# Altium schematic sheet UVB LED Controller.SchDoc: UVB LED Controller
size A3; Author: Peake J; CompanyName: Scion Research; DrawnBy: Peake J; Engineer: Peake J; Organization: Scion; Address1: 49 Sala St; Address2: Whakarewarewa; Address3: Rotorua; Address4: New Zealand 3010; DocumentNumber: NA; Revision: 0; SheetNumber: 1; SheetTotal: 2
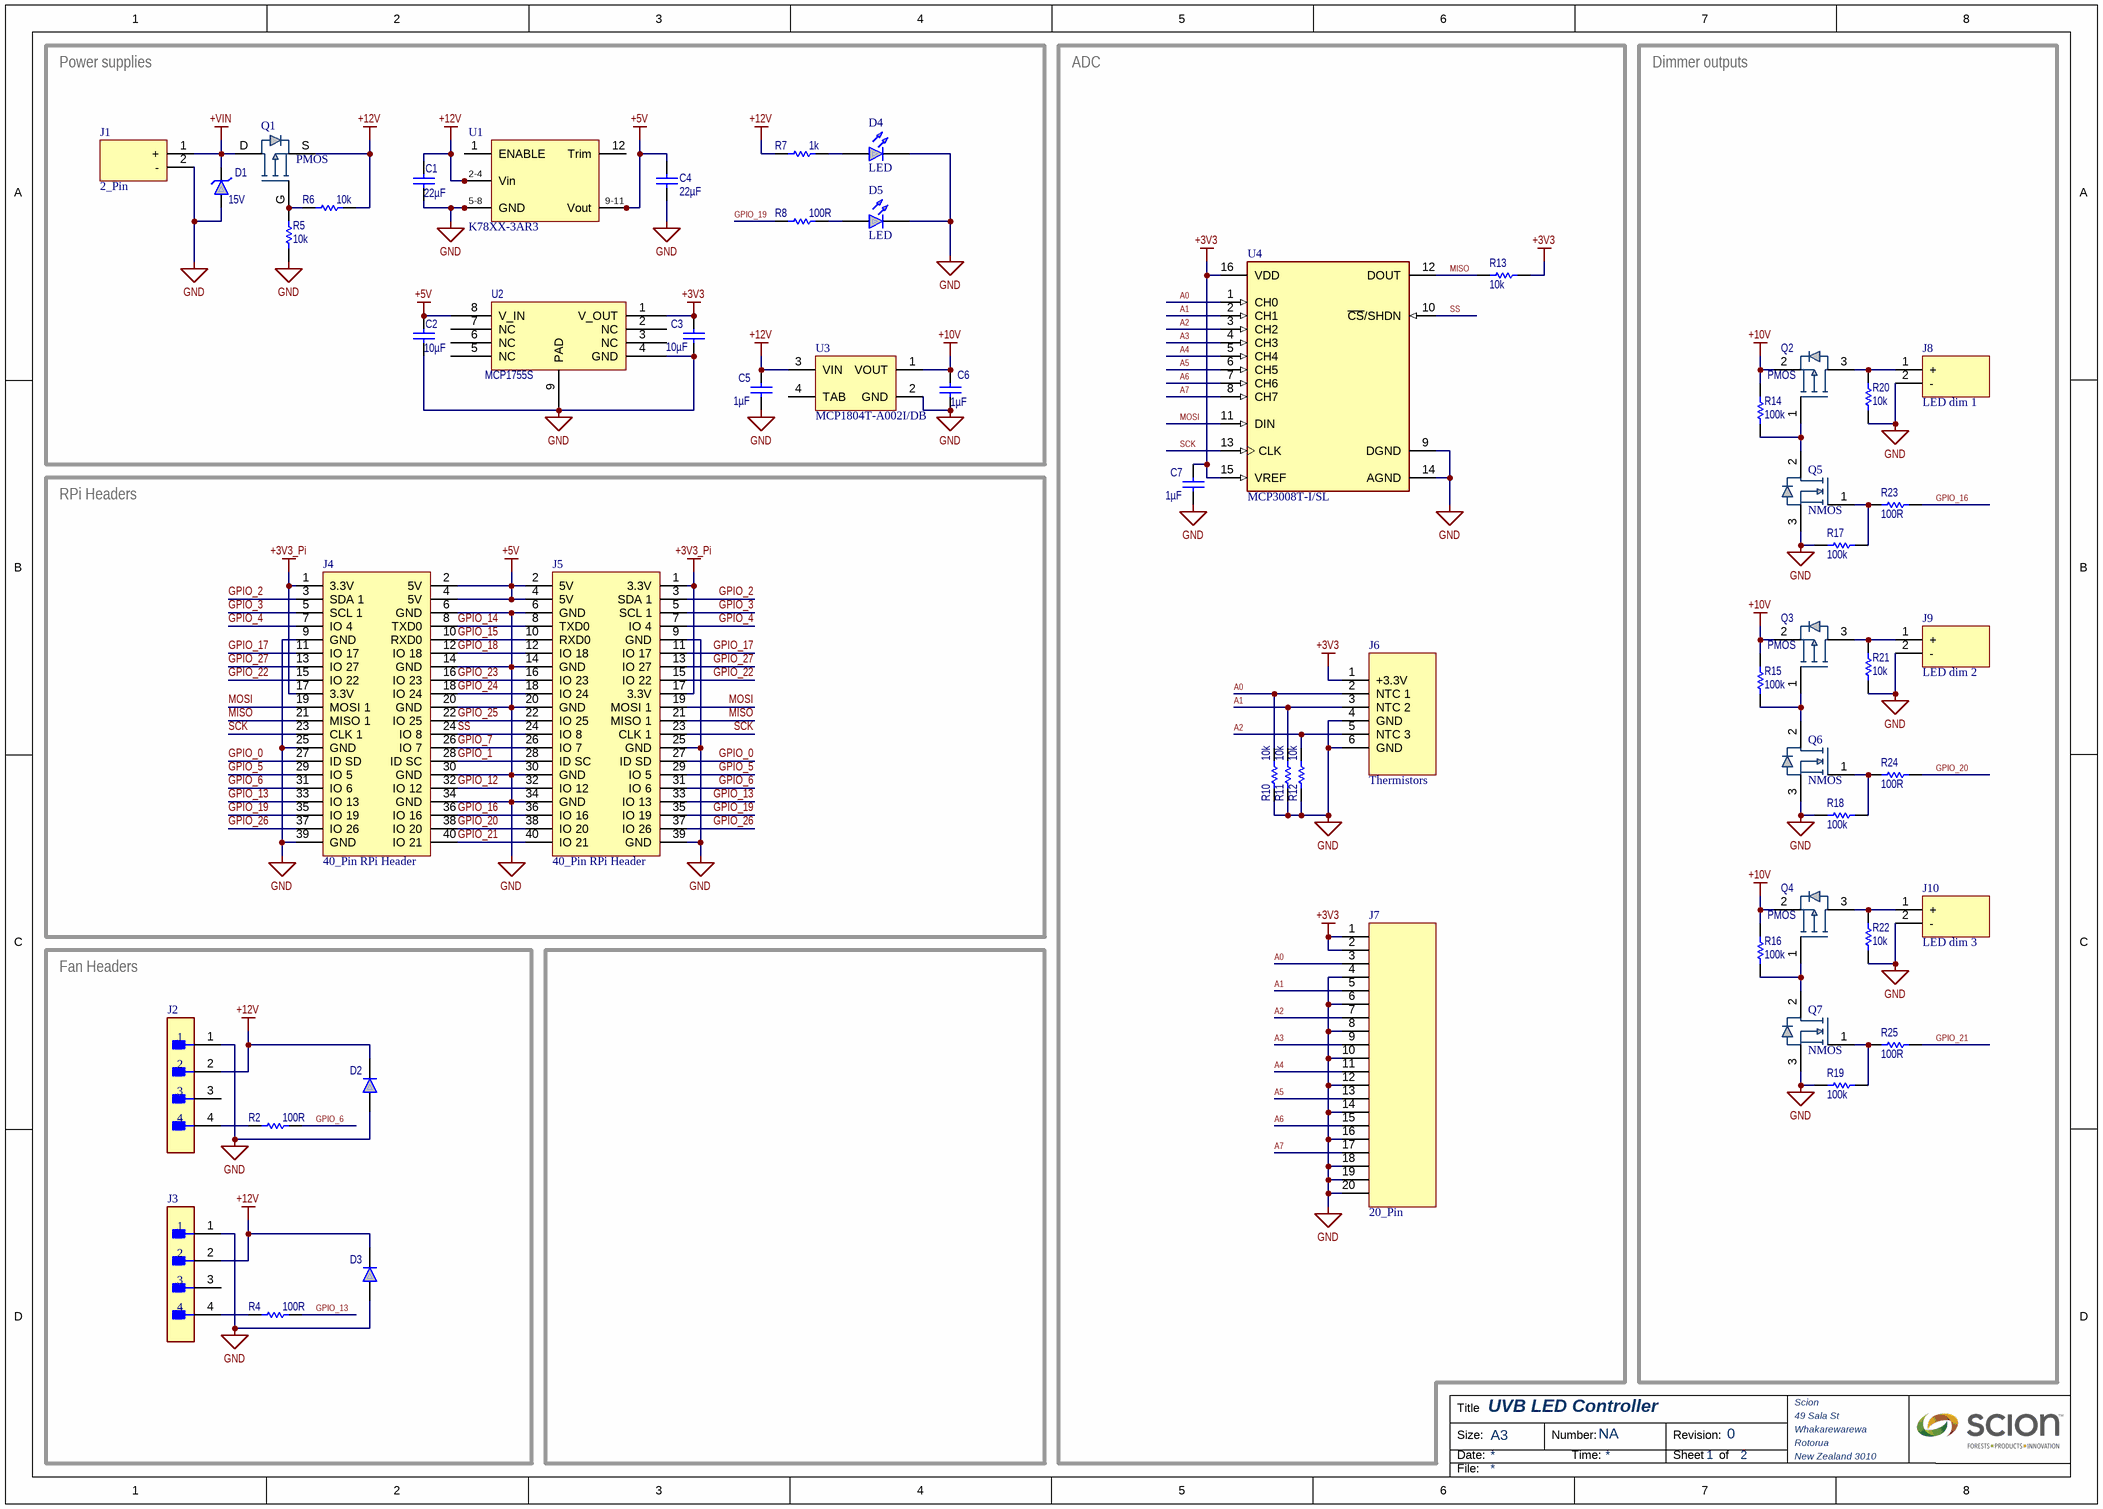
[diagram p0: UVB LED Controller.SchDoc]

## Parts
C1  value 22µF  [1206_CAP]  (hidden comment: Capacitor)
C2  value 10µF  [0603_CAP]  (hidden comment: Capacitor)
C3  value 10µF  [0603_CAP]  (hidden comment: Capacitor)
C4  value 22µF  [1206_CAP]  (hidden comment: Capacitor)
C5  value 1µF  [0603_CAP]  (hidden comment: Capacitor)
C6  value 1µF  [0603_CAP]  (hidden comment: Capacitor)
C7  value 1µF  [0603_CAP]  (hidden comment: Capacitor)
D1  Rated Voltage: 15V  [SMBJ]  (hidden comment: Transil)
D2  Diode  [SOD-123]  (value not drawn)
D3  Diode  [SOD-123]  (value not drawn)
D4  LED  [KPA-2106S_LED]
D5  LED  [KPA-2106S_LED]
J1  2_Pin  [2P 3.81mm Header Plugable]
J2  22-29-2041  [FP-22-29-2041-MFG]  (value not drawn)
J3  22-29-2041  [FP-22-29-2041-MFG]  (value not drawn)
J4  40_Pin RPi Header  [40_Pin_0.1in_male_header]
J5  40_Pin RPi Header  [40_Pin_0.1in_female_header]
J6  Thermistors  [6P RA MOLEX Clik-MATE 1.5mm]
J7  20_Pin  [20P 2.54mm DIP header]
J8  LED dim 1  [2P 3.81mm Header Plugable]
J9  LED dim 2  [2P 3.81mm Header Plugable]
J10  LED dim 3  [2P 3.81mm Header Plugable]
Q1  PMOS  [PowerDI 5060-8]
Q2  PMOS  [SOT-23-PMOS]
Q3  PMOS  [SOT-23-PMOS]
Q4  PMOS  [SOT-23-PMOS]
Q5  NMOS  [SOT-23]
Q6  NMOS  [SOT-23]
Q7  NMOS  [SOT-23]
R2  value 100R  [0603_RES]  (hidden comment: Resistor)
R4  value 100R  [0603_RES]  (hidden comment: Resistor)
R5  value 10k  [0603_RES]  (hidden comment: Resistor)
R6  value 10k  [0603_RES]  (hidden comment: Resistor)
R7  value 1k  [0603_RES]  (hidden comment: Resistor)
R8  value 100R  [0603_RES]  (hidden comment: Resistor)
R10  value 10k  [0603_RES]  (hidden comment: Resistor)
R11  value 10k  [0603_RES]  (hidden comment: Resistor)
R12  value 10k  [0603_RES]  (hidden comment: Resistor)
R13  value 10k  [0603_RES]  (hidden comment: Resistor)
R14  value 100k  [0603_RES]  (hidden comment: Resistor)
R15  value 100k  [0603_RES]  (hidden comment: Resistor)
R16  value 100k  [0603_RES]  (hidden comment: Resistor)
R17  value 100k  [0603_RES]  (hidden comment: Resistor)
R18  value 100k  [0603_RES]  (hidden comment: Resistor)
R19  value 100k  [0603_RES]  (hidden comment: Resistor)
R20  value 10k  [0603_RES]  (hidden comment: Resistor)
R21  value 10k  [0603_RES]  (hidden comment: Resistor)
R22  value 10k  [0603_RES]  (hidden comment: Resistor)
R23  value 100R  [0603_RES]  (hidden comment: Resistor)
R24  value 100R  [0603_RES]  (hidden comment: Resistor)
R25  value 100R  [0603_RES]  (hidden comment: Resistor)
U1  K78XX-3AR3  [K78XX-3AR3-Footprint]
U2  MCP1755S  [8P 2x3 DFN]
U3  MCP1804T-A002I/DB  [SOT-223-DB3_N]
U4  MCP3008T-I/SL  [FP-C04-108-MFG]

## Blocks framed on the sheet
Power supplies: C1-C6 D1 D4 D5 J1 Q1 R5-R8 U1-U3
ADC: C7 J6 J7 R10-R13 U4
Dimmer outputs: J8-J10 Q2-Q7 R14-R25
RPi Headers: J4 J5
Fan Headers: D2 D3 J2 J3 R2 R4

## Nets
+3V3: C3.1 C7.1 J6.1(+3.3V) J7.1 J7.2 R13.1 U2.1(V_OUT) U4.15(VREF) U4.16(VDD)
+3V3_Pi: J4.1(3.3V) J4.17(3.3V) J5.1(3.3V) J5.17(3.3V)
+5V: C2.1 C4.2 J4.2(5V) J4.4(5V) J5.2(5V) J5.4(5V) U1.9(Vout) U1.10(Vout) U1.11(Vout) U2.8(V_IN)
+10V: C6.1 Q2.2(S) Q3.2(S) Q4.2(S) R14.2 R15.2 R16.2 U3.1(VOUT)
+12V: C1.1 C5.1 D2.1(K) D3.1(K) J2.2 J3.2 Q1.S R6.2 R7.1 U1.2(Vin) U1.3(Vin) U1.4(Vin) U3.3(VIN)
+VIN: D1.2(K) J1.1(+) Q1.D
GND: C1.2 C2.2 C3.2 C4.1 C5.2 C6.2 C7.2 D1.1(A) D2.2(A) D3.2(A) D4.1(K) D5.1(K) J1.2(-) J2.1 J3.1 J4.6(GND) J4.9(GND) J4.14(GND) J4.20(GND) J4.25(GND) J4.30(GND) J4.34(GND) J4.39(GND) J5.6(GND) J5.9(GND) J5.14(GND) J5.20(GND) J5.25(GND) J5.30(GND) J5.34(GND) J5.39(GND) J6.4(GND) J6.6(GND) J7.4 J7.6 J7.8 J7.10 J7.12 J7.14 J7.16 J7.18 J7.19 J7.20 J8.2(-) J9.2(-) J10.2(-) Q5.3(S) Q6.3(S) Q7.3(S) R5.1 R10.1 R11.1 R12.1 R17.2 R18.2 R19.2 R20.1 R21.1 R22.1 U1.5(GND) U1.6(GND) U1.7(GND) U1.8(GND) U2.4(GND) U2.9(PAD) U3.2(GND) U4.9(DGND) U4.14(AGND)
A0: J6.2(NTC_1) J7.3 R10.2 U4.1(CH0)
A1: J6.3(NTC_2) J7.5 R11.2 U4.2(CH1)
A2: J6.5(NTC_3) J7.7 R12.2 U4.3(CH2)
A3: J7.9 U4.4(CH3)
A4: J7.11 U4.5(CH4)
A5: J7.13 U4.6(CH5)
A6: J7.15 U4.7(CH6)
A7: J7.17 U4.8(CH7)
GPIO_0: J4.27(ID_SD) J5.27(ID_SD)
GPIO_1: J4.28(ID_SC) J5.28(ID_SC)
GPIO_2: J4.3(SDA_1) J5.3(SDA_1)
GPIO_3: J4.5(SCL_1) J5.5(SCL_1)
GPIO_4: J4.7(IO_4) J5.7(IO_4)
GPIO_5: J4.29(IO_5) J5.29(IO_5)
GPIO_6: J4.31(IO_6) J5.31(IO_6) R2.2
GPIO_7: J4.26(IO_7) J5.26(IO_7)
GPIO_12: J4.32(IO_12) J5.32(IO_12)
GPIO_13: J4.33(IO_13) J5.33(IO_13) R4.2
GPIO_14: J4.8(TXD0) J5.8(TXD0)
GPIO_15: J4.10(RXD0) J5.10(RXD0)
GPIO_16: J4.36(IO_16) J5.36(IO_16) R23.1
GPIO_17: J4.11(IO_17) J5.11(IO_17)
GPIO_18: J4.12(IO_18) J5.12(IO_18)
GPIO_19: J4.35(IO_19) J5.35(IO_19) R8.1
GPIO_20: J4.38(IO_20) J5.38(IO_20) R24.1
GPIO_21: J4.40(IO_21) J5.40(IO_21) R25.1
GPIO_22: J4.15(IO_22) J5.15(IO_22)
GPIO_23: J4.16(IO_23) J5.16(IO_23)
GPIO_24: J4.18(IO_24) J5.18(IO_24)
GPIO_25: J4.22(IO_25) J5.22(IO_25)
GPIO_26: J4.37(IO_26) J5.37(IO_26)
GPIO_27: J4.13(IO_27) J5.13(IO_27)
MISO: J4.21(MISO_1) J5.21(MISO_1) R13.2 U4.12(DOUT)
MOSI: J4.19(MOSI_1) J5.19(MOSI_1) U4.11(DIN)
SCK: J4.23(CLK_1) J5.23(CLK_1) U4.13(CLK)
SS: J4.24(IO_8) J5.24(IO_8) U4.10(~{CS}/SHDN)
NetD4_2: D4.2(A) R7.2
NetD5_2: D5.2(A) R8.2
NetJ2_4: J2.4 R2.1
NetJ3_4: J3.4 R4.1
NetJ8_1: J8.1(+) Q2.3(D) R20.2
NetJ9_1: J9.1(+) Q3.3(D) R21.2
NetJ10_1: J10.1(+) Q4.3(D) R22.2
NetQ1_G: Q1.G R5.2 R6.1
NetQ2_1: Q2.1(G) Q5.2(D) R14.1
NetQ3_1: Q3.1(G) Q6.2(D) R15.1
NetQ4_1: Q4.1(G) Q7.2(D) R16.1
NetQ5_1: Q5.1(G) R17.1 R23.2
NetQ6_1: Q6.1(G) R18.1 R24.2
NetQ7_1: Q7.1(G) R19.1 R25.2

Not connected (* = marked no-connect by the designer): J2 3; J3 3; U1 1(ENABLE) 12(Trim); U2 2(NC) 3(NC) 5(NC) 6(NC) 7(NC); U3 4(TAB)

## Notes on the sheet
- Title
- Size:
- Date:
- A3
- Number:
- Time:
- Revision:
- Sheet
- of
- File:
- (in symbol CMP-015-000000-2) 2-4; 5-8; 9-11

## Library data of the parts
C1-C7 = CMP-001-00172-2: SMD Capacitor; Pins: 2; Source: Discrete.SchLib; Design Item ID: Capacitor; Component Type: Standard
D1 = CMP-079-000108-2: Transient Voltage Suppressor; MFN: SMBJ33A; Component Type: Standard; Pin Count: 2; Source: Discrete.SchLib; Breakdown Voltage: *; Design Item ID: Transil; Clamping Voltage: *
D2 D3 = CMP-004-00083-4: SMD Diode; Design Item ID: Diode; Pins: 2; Source: Discrete.SchLib; Component Type: Standard; Pin Count: 2
D4 D5 = CMP-004-00084-2: SMD LED; Colour: RED; Source: Discrete.SchLib; Design Item ID: LED; Component Type: Standard; Pin Count: 2; Pins: 2
J1 J8-J10 = CMP-002-00173-1: 2 Pin Connector; Design Item ID: 2_Pin; Pins: 2; Pin Count: 2; MFN: *; Component Type: Standard; Source: Connectors.SchLib
J2 J3 = CMP-04776-000366-1: CONN HEADER VERT 4POS 2.54MM; Insulation Resistance: 50GR; Voltage Rating: 250V; Glow Wire Compliant: Non-compliant; Max Current Rating: 4A; Number of Circuits: 4; Contact Resistance: 10mR; Gender: Male; Number of Lines: 1; Length: 10.16mm; Radiation Hardening: No; Pitch: 2.54mm; Contact Material: Brass; Height: 11.7mm; Max Operating Temperature: 75°C; Flammability Rating: UL94 V-0; Mount: Through Hole; Voltage Rating (DC): 250V; Halogen Free: Low Halogen; Housing Color: White; Package Quantity: 1500; Series: KK® 6410; Number of Rows: 1; Housing Material: Nylon; Depth: 5.8mm; RoHS Compliant: Yes; Orientation: Straight; Contact Gender: Male; Color: Natural; Current Rating: 4A; Contact Mating Length: 0.295inch; Number of Poles: 4; Packaging: Bulk; Contact Type: Male Pin; Termination: Solder; Number of Positions: 4; Number of Contacts: 4; Lead Free: Lead Free; Min Operating Temperature: 0°C; Fastening Type: Friction; Contact Plating: Gold
J4 J5 = CMP-002-00133-3: 40 pin header for Raspberry Pi compatible connections; Source: All Components - 30.06.23 - 18.27.SchLib; Component Type: Standard; Pin Count: 40; Design Item ID: CMP-00031-2
J6 = CMP-002-00180-3: 6 Pin Connector; Pins: 6; Component Type: Standard; Pin Count: 6; Design Item ID: 6_Pin; Source: Connectors.SchLib
J7 = CMP-002-00001-3: 20 pin connector
Q1 = CMP-079-000102-2: P Channel MOSFET; MFN: *; Design Item ID: PMOS GDS; VGS Max: *; Continuous Current: *; VDS Breakdown: *; Source: P-MOS.SchLib; Component Type: Standard; Pin Count: 3
Q2-Q4 = CMP-079-000100-1: P Channel MOSFET; MFN: BSS308PE; Source: P-MOS.SchLib; Component Type: Standard; Design Item ID: PMOS; Pin Count: 3
Q5-Q7 = CMP-079-000093-2: N Channel MOSFET; Design Item ID: NMOS; Source: N-MOS.SchLib; MFN: *; Pin Count: 3; Component Type: Standard
R2 R4-R8 R10-R25 = CMP-009-00356-1: SMD Resistor; Pins: 2; Source: Discrete.SchLib; Component Type: Standard; Design Item ID: Resistor
U1 = CMP-015-000000-2: Mornsun DC-DC power module 3A, 0-36Vin, 3.3-15V out
U2 = CMP-079-000090-2: LDO Linear Voltage Regulator; Pin Count: 9; Component Type: Standard; Source: Microchip.SchLib; Design Item ID: MCP1755S
U3 = CMP-0136-00501-1: 150 mA, 28V LDO Regulator With Shutdown, 3-Pin SOT-223, Industrial Temperature, Tape and Reel; PackageDescription: 3-Lead Plastic Small Outline Transistor (DB) [SOT-223]; PackageReference: SOT-223-DB3; DatasheetVersion: revB, Nov-2009; PackageVersion: revBB, Aug-2009
U4 = CMP-0188-00351-3: IC ADC 10BIT SAR 16SOIC; Resolution: 10b; Output Voltage: 4.1V; Number of Channels: 8; Number of Elements: 1; Number of Bits: 10; Full Scale Error: 1LSB; Signal to Noise Ratio (SNR): 200dB; Interface: SPI; Nominal Supply Current: 425uA; Sampling Rate: 200KS/s; Supply Type: Single; Min Supply Voltage: 2.7V; Max Supply Voltage: 5.5V; Operating Supply Voltage: 5V; Polarity: Unipolar; Min Operating Temperature: -40°C; REACH SVHC: No SVHC; Integral Nonlinearity (INL): 1LSB; Mount: Surface Mount; Number of Converters: 1; Differential Nonlinearity: 1LSB; Contact Plating: Tin; Lead Free: Lead Free; Conversion Rate: 200KS/s; Radiation Hardening: No; Max Operating Temperature: 85°C; Case/Package: SOIC; Package Quantity: 2600; Number of Pins: 16; Packaging: Tape and Reel; Number of A/D Converters: 1